# Altium schematic sheet Bandpass.SchDoc
size A; SheetNumber: 2; SheetTotal: 4
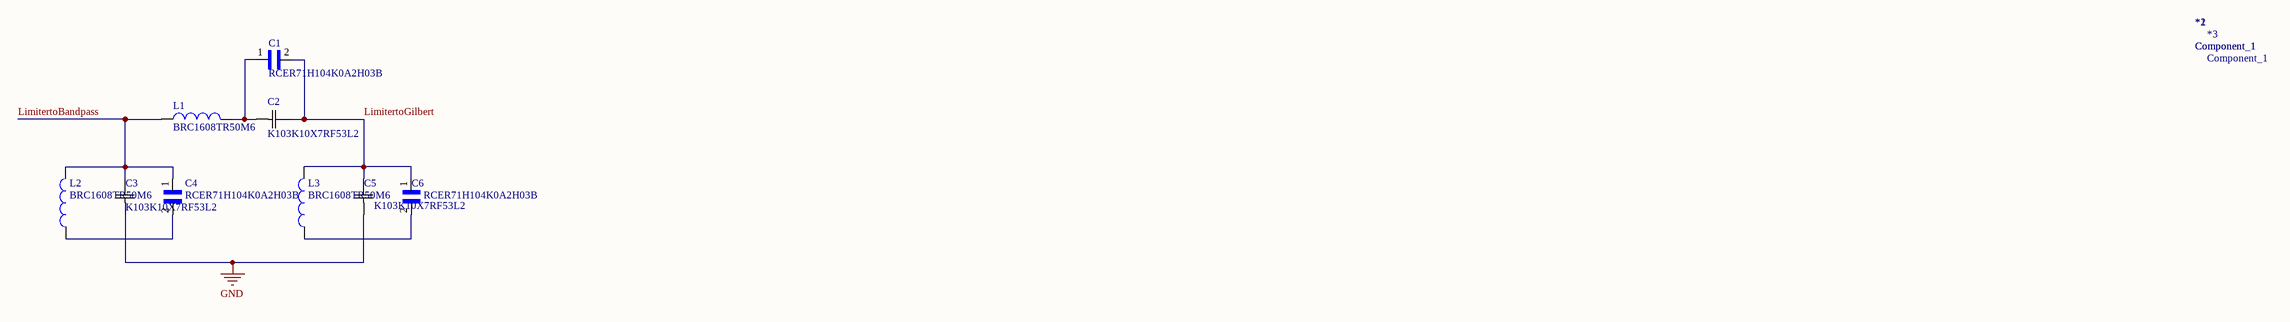
[diagram p0: Bandpass.SchDoc]

## Parts
*1  Component_1
*2  Component_1
*3  Component_1
C1  RCER71H104K0A2H03B  [CAP_RCER71H104K0A2H03B]
C2  K103K10X7RF53L2  [K103K10X7RF53L2_VIS]
C3  K103K10X7RF53L2  [K103K10X7RF53L2_VIS]
C4  RCER71H104K0A2H03B  [CAP_RCER71H104K0A2H03B]
C5  K103K10X7RF53L2  [K103K10X7RF53L2_VIS]
C6  RCER71H104K0A2H03B  [CAP_RCER71H104K0A2H03B]
L1  BRC1608TR50M6  [INDC1608X100N]
L2  BRC1608TR50M6  [INDC1608X100N]
L3  BRC1608TR50M6  [INDC1608X100N]

## Nets
GND: C3.1 C5.1
LimitertoBandpass: C3.2 C4.1 L1.1 L2.2
LimitertoGilbert: C1.2 C2.2 C5.2 C6.1 L3.2
NetC1_1: C1.1 C2.1 L1.2
NetC4_2: C4.2 L2.1
NetC6_2: C6.2 L3.1

## Library data of the parts
C1 C4 C6 = RCER71H104K0A2H03B: Cap Ceramic 1pF 50V C0G 0.25pF Radial 2.5mm 125C Automotive Bulk; Package: None; Price: None; Value: *; MP: RCER71H104K0A2H03B; Availability: Unavailable
C2 C3 C5 = K103K10X7RF53L2: No Description Available; Mfr_Name: Vishay; Type: Ceramic Capacitor
L1-L3 = BRC1608TR50M6: Inductor Power Chip Wirewound 500nH 20% 6MHz Ferrite 1.05A 117mOhm DCR 0603 T/R; Package: None; Price: None; Value: *; MP: BRC1608TR50M6; Availability: Unavailable